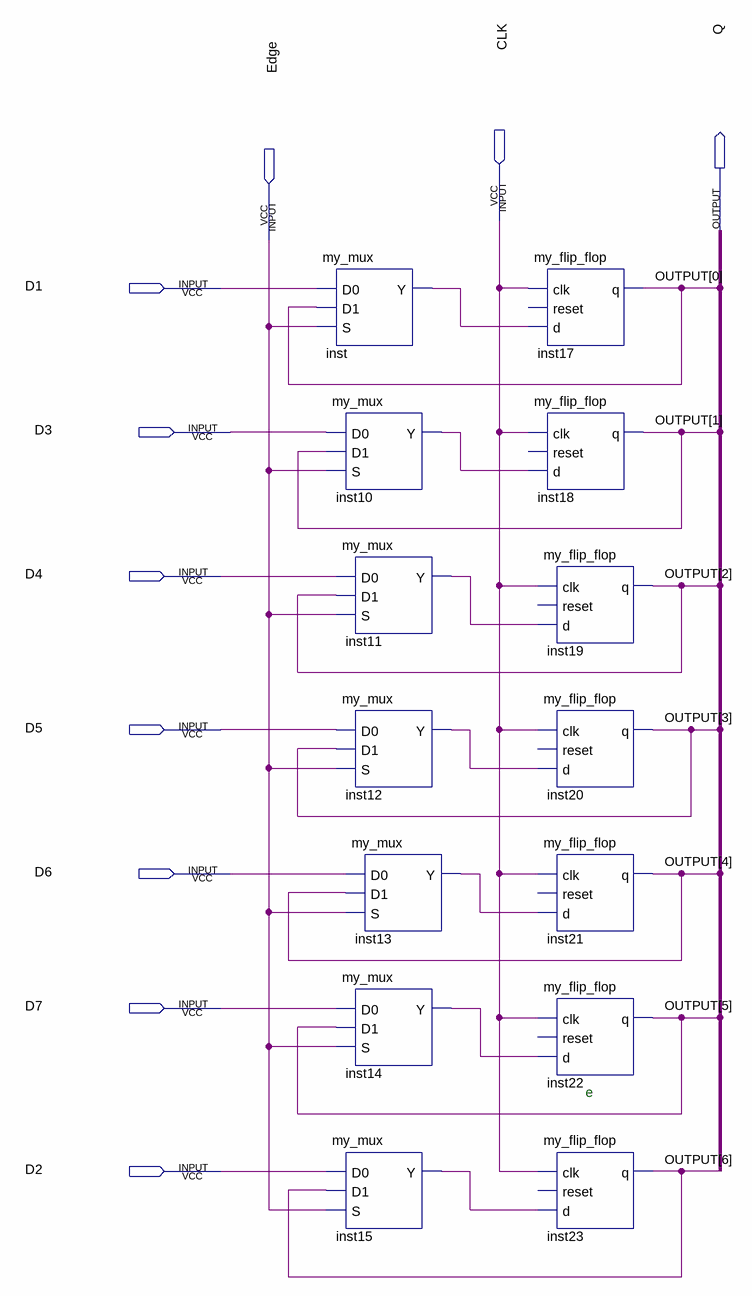
[diagram p0: schematic sheet]
// Quartus schematic memory.bdf as structural Verilog: 14 symbols, 10 pins
module memory (
  input  CLK,
  input  Edge,
  input  D1,
  input  D3,
  input  D4,
  input  D5,
  input  D6,
  input  D7,
  input  D2,
  output Q
);

  wire inst10_y, inst11_y, inst12_y, inst13_y, inst14_y, inst15_y, inst_y;
  wire [6:0] OUTPUT;

  my_mux inst (.D0(D1), .D1(OUTPUT[0]), .S(Edge), .Y(inst_y));
  my_mux inst10 (.D0(D3), .D1(OUTPUT[1]), .S(Edge), .Y(inst10_y));
  my_mux inst11 (.D0(D4), .D1(OUTPUT[2]), .S(Edge), .Y(inst11_y));
  my_mux inst12 (.D0(D5), .D1(OUTPUT[3]), .S(Edge), .Y(inst12_y));
  my_mux inst13 (.D0(D6), .D1(OUTPUT[4]), .S(Edge), .Y(inst13_y));
  my_mux inst14 (.D0(D7), .D1(OUTPUT[5]), .S(Edge), .Y(inst14_y));
  my_mux inst15 (.D0(D2), .D1(OUTPUT[6]), .S(Edge), .Y(inst15_y));
  my_flip_flop inst17 (.clk(CLK), .d(inst_y), .q(OUTPUT[0]));  // open: reset
  my_flip_flop inst18 (.clk(CLK), .d(inst10_y), .q(OUTPUT[1]));  // open: reset
  my_flip_flop inst19 (.clk(CLK), .d(inst11_y), .q(OUTPUT[2]));  // open: reset
  my_flip_flop inst20 (.clk(CLK), .d(inst12_y), .q(OUTPUT[3]));  // open: reset
  my_flip_flop inst21 (.clk(CLK), .d(inst13_y), .q(OUTPUT[4]));  // open: reset
  my_flip_flop inst22 (.clk(CLK), .d(inst14_y), .q(OUTPUT[5]));  // open: reset
  my_flip_flop inst23 (.clk(CLK), .d(inst15_y), .q(OUTPUT[6]));  // open: reset

  // Notes on the sheet:
  //   e
endmodule
